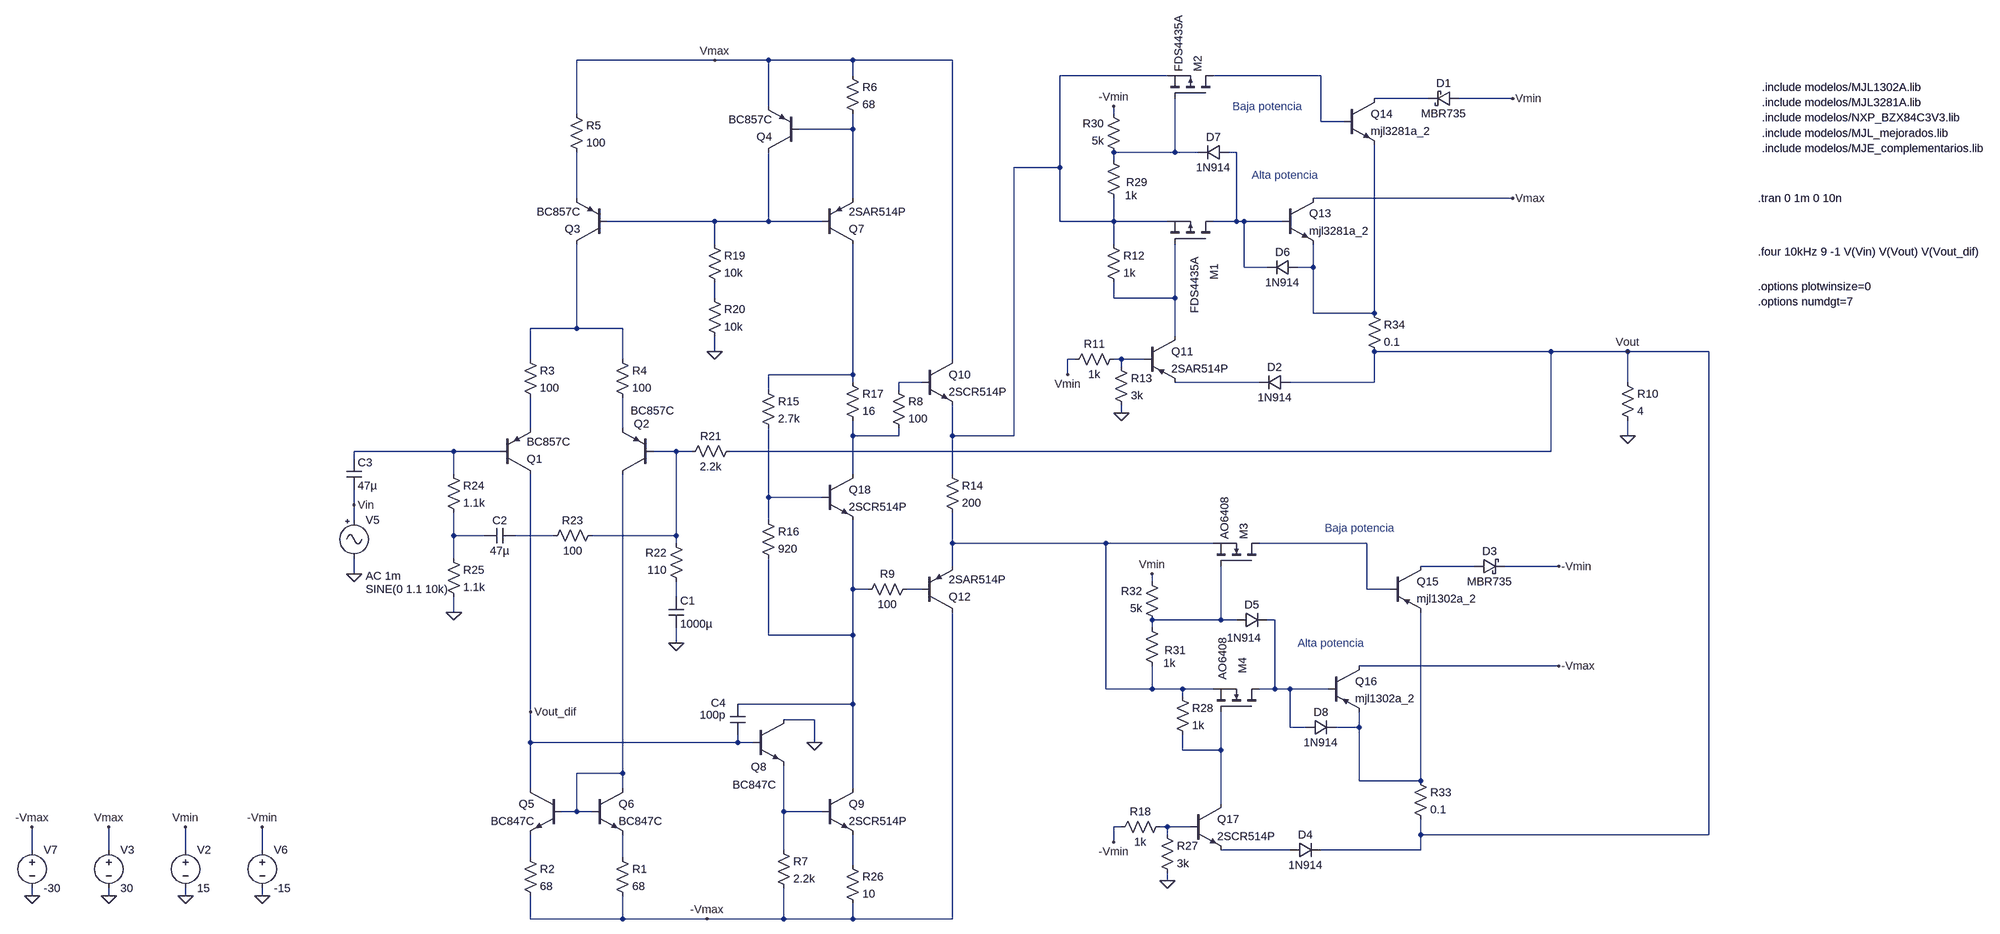
[diagram p0: schematic tp_final_amplificador_salida_paralelo_analisis_distorsion.asc]
tp_final_amplificador_salida_paralelo_analisis_distorsion.asc, the LTspice schematic file:
Version 4
SHEET 1 1744 1200
WIRE -1024 -896 -1312 -896
WIRE -912 -896 -1024 -896
WIRE -736 -896 -912 -896
WIRE -528 -896 -736 -896
WIRE -736 -864 -736 -896
WIRE -80 -864 -304 -864
WIRE 240 -864 16 -864
WIRE 464 -816 352 -816
WIRE 640 -816 528 -816
WIRE -912 -800 -912 -896
WIRE -1312 -784 -1312 -896
WIRE -192 -784 -192 -800
WIRE 240 -768 240 -864
WIRE 288 -768 240 -768
WIRE -736 -752 -736 -784
WIRE -736 -752 -848 -752
WIRE -64 -704 -64 -816
WIRE -64 -704 -192 -704
WIRE -16 -704 -64 -704
WIRE 64 -704 48 -704
WIRE -192 -688 -192 -704
WIRE -304 -672 -304 -864
WIRE -304 -672 -400 -672
WIRE -1312 -608 -1312 -704
WIRE -736 -608 -736 -752
WIRE 640 -608 224 -608
WIRE -1024 -560 -1248 -560
WIRE -912 -560 -912 -704
WIRE -912 -560 -1024 -560
WIRE -800 -560 -912 -560
WIRE -304 -560 -304 -672
WIRE -192 -560 -192 -608
WIRE -192 -560 -304 -560
WIRE -80 -560 -192 -560
WIRE 64 -560 64 -704
WIRE 64 -560 16 -560
WIRE 80 -560 64 -560
WIRE 160 -560 80 -560
WIRE -1024 -512 -1024 -560
WIRE -192 -512 -192 -560
WIRE 80 -464 80 -560
WIRE 128 -464 80 -464
WIRE 224 -464 224 -512
WIRE 224 -464 192 -464
WIRE -1024 -400 -1024 -432
WIRE -192 -400 -192 -432
WIRE -64 -400 -64 -512
WIRE -64 -400 -192 -400
WIRE 224 -368 224 -464
WIRE 352 -368 352 -720
WIRE 352 -368 224 -368
WIRE -1312 -336 -1312 -512
WIRE -1312 -336 -1408 -336
WIRE -1216 -336 -1312 -336
WIRE -64 -320 -64 -400
WIRE -1024 -288 -1024 -320
WIRE 720 -288 352 -288
WIRE 880 -288 720 -288
WIRE 1104 -288 880 -288
WIRE -1408 -272 -1408 -336
WIRE -1216 -272 -1216 -336
WIRE -528 -272 -528 -896
WIRE -272 -272 -288 -272
WIRE -176 -272 -192 -272
WIRE -128 -272 -176 -272
WIRE -176 -256 -176 -272
WIRE -736 -240 -736 -512
WIRE -736 -240 -912 -240
WIRE -288 -240 -288 -272
WIRE -736 -224 -736 -240
WIRE -592 -224 -640 -224
WIRE 112 -224 -64 -224
WIRE 352 -224 352 -288
WIRE 352 -224 176 -224
WIRE 880 -224 880 -288
WIRE -912 -208 -912 -240
WIRE -640 -208 -640 -224
WIRE -176 -160 -176 -176
WIRE -1408 -128 -1408 -192
WIRE -1216 -128 -1216 -192
WIRE -736 -112 -736 -144
WIRE -640 -112 -640 -128
WIRE -640 -112 -736 -112
WIRE -528 -112 -528 -176
WIRE -400 -112 -400 -672
WIRE -400 -112 -528 -112
WIRE 880 -112 880 -144
WIRE -1568 -80 -1776 -80
WIRE -1472 -80 -1568 -80
WIRE -1104 -80 -1152 -80
WIRE -1072 -80 -1104 -80
WIRE 720 -80 720 -288
WIRE 720 -80 -992 -80
WIRE -1776 -64 -1776 -80
WIRE -1568 -32 -1568 -80
WIRE -736 -32 -736 -112
WIRE -528 -32 -528 -112
WIRE -912 16 -912 -128
WIRE -800 16 -912 16
WIRE -1776 32 -1776 0
WIRE -1776 64 -1776 32
WIRE -912 64 -912 16
WIRE -1568 96 -1568 48
WIRE -1504 96 -1568 96
WIRE -1360 96 -1440 96
WIRE -1104 96 -1104 -80
WIRE -1104 96 -1280 96
WIRE -1104 112 -1104 96
WIRE -528 112 -528 48
WIRE -208 112 -528 112
WIRE 16 112 -208 112
WIRE 336 112 112 112
WIRE -1568 144 -1568 96
WIRE -528 160 -528 112
WIRE 560 160 448 160
WIRE 736 160 624 160
WIRE -1776 176 -1776 144
WIRE -112 192 -112 176
WIRE -736 208 -736 64
WIRE -704 208 -736 208
WIRE -592 208 -624 208
WIRE 336 208 336 112
WIRE 384 208 336 208
WIRE -1104 224 -1104 192
WIRE -1568 256 -1568 224
WIRE 32 272 32 160
WIRE 32 272 -112 272
WIRE 64 272 32 272
WIRE 144 272 128 272
WIRE -112 288 -112 272
WIRE -912 304 -912 144
WIRE -736 304 -736 208
WIRE -736 304 -912 304
WIRE -1104 320 -1104 288
WIRE 736 368 320 368
WIRE -208 416 -208 112
WIRE -112 416 -112 368
WIRE -112 416 -208 416
WIRE -48 416 -112 416
WIRE 16 416 -48 416
WIRE 144 416 144 272
WIRE 144 416 112 416
WIRE 176 416 144 416
WIRE 256 416 176 416
WIRE -48 432 -48 416
WIRE -736 448 -736 304
WIRE -736 448 -976 448
WIRE -1408 464 -1408 -32
WIRE -816 480 -880 480
WIRE 176 496 176 416
WIRE 208 496 176 496
WIRE 320 496 320 464
WIRE 320 496 272 496
WIRE -1408 528 -1408 464
WIRE -976 528 -976 512
WIRE -976 528 -1408 528
WIRE -944 528 -976 528
WIRE -816 528 -816 480
WIRE -48 544 -48 512
WIRE 32 544 32 464
WIRE 32 544 -48 544
WIRE -1216 592 -1216 -32
WIRE -1216 592 -1312 592
WIRE 320 608 320 496
WIRE 448 608 448 256
WIRE 448 608 320 608
WIRE -1408 624 -1408 528
WIRE -1216 624 -1216 592
WIRE -736 624 -736 448
WIRE 32 656 32 544
WIRE -1312 672 -1312 592
WIRE -1312 672 -1344 672
WIRE -1280 672 -1312 672
WIRE -880 672 -880 576
WIRE -800 672 -880 672
WIRE -176 704 -192 704
WIRE -80 704 -96 704
WIRE -32 704 -80 704
WIRE -80 720 -80 704
WIRE 448 720 448 688
WIRE 1104 720 1104 -288
WIRE 1104 720 448 720
WIRE -192 736 -192 704
WIRE -3296 752 -3296 704
WIRE -3136 752 -3136 704
WIRE -2976 752 -2976 704
WIRE -2816 752 -2816 704
WIRE -880 752 -880 672
WIRE 176 752 32 752
WIRE 448 752 448 720
WIRE 448 752 240 752
WIRE -1408 768 -1408 720
WIRE -1216 768 -1216 720
WIRE -736 784 -736 720
WIRE -80 816 -80 800
WIRE -3296 848 -3296 832
WIRE -3136 848 -3136 832
WIRE -2976 848 -2976 832
WIRE -2816 848 -2816 832
WIRE -1408 896 -1408 848
WIRE -1216 896 -1216 848
WIRE -1216 896 -1408 896
WIRE -1040 896 -1216 896
WIRE -880 896 -880 832
WIRE -880 896 -1040 896
WIRE -736 896 -736 864
WIRE -736 896 -880 896
WIRE -528 896 -528 256
WIRE -528 896 -736 896
FLAG -816 528 0
FLAG -1024 -288 0
FLAG -1104 320 0
FLAG -1568 256 0
FLAG -1776 176 0
FLAG -2976 848 0
FLAG -2976 704 Vmin
FLAG -3136 704 Vmax
FLAG -3136 848 0
FLAG -2816 848 0
FLAG -2816 704 -Vmin
FLAG -3296 704 -Vmax
FLAG -3296 848 0
FLAG 640 -816 Vmin
FLAG 640 -608 Vmax
FLAG -288 -240 Vmin
FLAG -176 -160 0
FLAG 736 160 -Vmin
FLAG 736 368 -Vmax
FLAG -192 736 -Vmin
FLAG -80 816 0
FLAG -1024 -896 Vmax
FLAG -1040 896 -Vmax
FLAG 880 -112 0
FLAG -192 -800 -Vmin
FLAG -112 176 Vmin
FLAG 880 -288 Vout
FLAG -1408 464 Vout_dif
FLAG -1776 32 Vin
SYMBOL pnp -1472 -32 M180
SYMATTR InstName Q1
SYMATTR Value BC857C
SYMBOL pnp -1152 -32 R180
WINDOW 0 8 105 Left 2
WINDOW 3 -44 133 Left 2
SYMATTR InstName Q2
SYMATTR Value BC857C
SYMBOL pnp -1248 -512 R180
SYMATTR InstName Q3
SYMATTR Value BC857C
SYMBOL pnp -848 -704 R180
SYMATTR InstName Q4
SYMATTR Value BC857C
SYMBOL npn -1344 624 M0
SYMATTR InstName Q5
SYMATTR Value BC847C
SYMBOL npn -1280 624 R0
SYMATTR InstName Q6
SYMATTR Value BC847C
SYMBOL res -1232 752 R0
SYMATTR InstName R1
SYMATTR Value 68
SYMBOL res -1424 752 R0
SYMATTR InstName R2
SYMATTR Value 68
SYMBOL res -1424 -288 R0
SYMATTR InstName R3
SYMATTR Value 100
SYMBOL res -1232 -288 R0
SYMATTR InstName R4
SYMATTR Value 100
SYMBOL res -1328 -800 R0
SYMATTR InstName R5
SYMATTR Value 100
SYMBOL res -752 -880 R0
SYMATTR InstName R6
SYMATTR Value 68
SYMBOL pnp -800 -512 M180
SYMATTR InstName Q7
SYMATTR Value 2SAR514P
SYMBOL npn -944 480 R0
WINDOW 0 -4 99 Left 2
WINDOW 3 -43 136 Left 2
SYMATTR InstName Q8
SYMATTR Value BC847C
SYMBOL npn -800 624 R0
SYMATTR InstName Q9
SYMATTR Value 2SCR514P
SYMBOL res -896 736 R0
SYMATTR InstName R7
SYMATTR Value 2.2k
SYMBOL res -608 192 R90
WINDOW 0 0 56 VBottom 2
WINDOW 3 32 56 VTop 2
SYMATTR InstName R9
SYMATTR Value 100
SYMBOL npn -592 -272 R0
SYMATTR InstName Q10
SYMATTR Value 2SCR514P
SYMBOL pnp -592 256 M180
SYMATTR InstName Q12
SYMATTR Value 2SAR514P
SYMBOL npn -800 -32 R0
SYMATTR InstName Q18
SYMATTR Value 2SCR514P
SYMBOL res -928 -224 R0
SYMATTR InstName R15
SYMATTR Value 2.7k
SYMBOL res -928 48 R0
SYMATTR InstName R16
SYMATTR Value 920
SYMBOL res -752 -240 R0
SYMATTR InstName R17
SYMATTR Value 16
SYMBOL res -1040 -528 R0
SYMATTR InstName R19
SYMATTR Value 10k
SYMBOL res -1040 -416 R0
SYMATTR InstName R20
SYMATTR Value 10k
SYMBOL res -976 -96 R90
WINDOW 0 0 56 VBottom 2
WINDOW 3 32 56 VTop 2
SYMATTR InstName R21
SYMATTR Value 2.2k
SYMBOL res -1088 208 R180
WINDOW 0 36 76 Left 2
WINDOW 3 36 40 Left 2
SYMATTR InstName R22
SYMATTR Value 110
SYMBOL cap -1120 224 R0
SYMATTR InstName C1
SYMATTR Value 1000µ
SYMBOL res -1264 80 R90
WINDOW 0 0 56 VBottom 2
WINDOW 3 32 56 VTop 2
SYMATTR InstName R23
SYMATTR Value 100
SYMBOL cap -1440 80 R90
WINDOW 0 0 32 VBottom 2
WINDOW 3 32 32 VTop 2
SYMATTR InstName C2
SYMATTR Value 47µ
SYMBOL res -1584 -48 R0
SYMATTR InstName R24
SYMATTR Value 1.1k
SYMBOL res -1584 128 R0
SYMATTR InstName R25
SYMATTR Value 1.1k
SYMBOL cap -1792 -64 R0
SYMATTR InstName C3
SYMATTR Value 47µ
SYMBOL res -752 768 R0
SYMATTR InstName R26
SYMATTR Value 10
SYMBOL Misc\\signal -1776 48 R0
WINDOW 123 24 132 Left 2
WINDOW 39 0 0 Left 0
WINDOW 3 24 160 Left 2
SYMATTR Value2 AC 1m
SYMATTR Value SINE(0 1.1 10k)
SYMATTR InstName V5
SYMBOL cap -992 448 R0
WINDOW 0 -40 -3 Left 2
WINDOW 3 -63 22 Left 2
SYMATTR InstName C4
SYMATTR Value 100p
SYMBOL res -656 -224 R0
SYMATTR InstName R8
SYMATTR Value 100
SYMBOL voltage -2976 736 R0
WINDOW 123 0 0 Left 0
WINDOW 39 0 0 Left 0
SYMATTR InstName V2
SYMATTR Value 15
SYMBOL voltage -3136 736 R0
WINDOW 123 0 0 Left 0
WINDOW 39 0 0 Left 0
SYMATTR InstName V3
SYMATTR Value 30
SYMBOL voltage -2816 736 R0
WINDOW 123 0 0 Left 0
WINDOW 39 0 0 Left 0
SYMATTR InstName V6
SYMATTR Value -15
SYMBOL voltage -3296 736 R0
WINDOW 123 0 0 Left 0
WINDOW 39 0 0 Left 0
SYMATTR InstName V7
SYMATTR Value -30
SYMBOL pmos 16 -512 M270
WINDOW 0 -74 -2 Left 2
WINDOW 3 -144 39 Left 2
SYMATTR InstName M1
SYMATTR Value FDS4435A
SYMBOL pmos 16 -816 M270
SYMATTR InstName M2
SYMATTR Value FDS4435A
SYMBOL pnp -128 -320 R0
SYMATTR InstName Q11
SYMATTR Value 2SAR514P
SYMBOL npn 160 -608 R0
SYMATTR InstName Q13
SYMATTR Value mjl3281a_2
SYMBOL npn 288 -816 R0
SYMATTR InstName Q14
SYMATTR Value mjl3281a_2
SYMBOL res -176 -288 R90
WINDOW 0 0 56 VBottom 2
WINDOW 3 32 56 VTop 2
SYMATTR InstName R11
SYMATTR Value 1k
SYMBOL res -208 -528 R0
SYMATTR InstName R12
SYMATTR Value 1k
SYMBOL schottky 528 -832 R90
WINDOW 0 0 32 VBottom 2
WINDOW 3 32 32 VTop 2
SYMATTR InstName D1
SYMATTR Value MBR735
SYMATTR Description Diode
SYMATTR Type diode
SYMBOL res -192 -272 R0
SYMATTR InstName R13
SYMATTR Value 3k
SYMBOL res -80 688 R90
WINDOW 0 0 56 VBottom 2
WINDOW 3 32 56 VTop 2
SYMATTR InstName R18
SYMATTR Value 1k
SYMBOL schottky 560 176 R270
WINDOW 0 32 32 VTop 2
WINDOW 3 0 32 VBottom 2
SYMATTR InstName D3
SYMATTR Value MBR735
SYMATTR Description Diode
SYMATTR Type diode
SYMBOL res -96 704 R0
SYMATTR InstName R27
SYMATTR Value 3k
SYMBOL pnp 384 160 R0
SYMATTR InstName Q15
SYMATTR Value mjl1302a_2
SYMBOL pnp 256 368 R0
SYMATTR InstName Q16
SYMATTR Value mjl1302a_2
SYMBOL nmos 112 160 M270
SYMATTR InstName M3
SYMATTR Value AO6408
SYMBOL nmos 112 464 M270
WINDOW 0 80 35 Left 2
WINDOW 3 67 76 Left 2
SYMATTR InstName M4
SYMATTR Value AO6408
SYMBOL res -64 416 R0
SYMATTR InstName R28
SYMATTR Value 1k
SYMBOL npn -32 656 R0
SYMATTR InstName Q17
SYMATTR Value 2SCR514P
SYMBOL res 864 -240 R0
SYMATTR InstName R10
SYMATTR Value 4
SYMBOL res -544 -48 R0
SYMATTR InstName R14
SYMATTR Value 200
SYMBOL diode 176 -240 R90
WINDOW 0 0 32 VBottom 2
WINDOW 3 32 32 VTop 2
SYMATTR InstName D2
SYMATTR Value 1N914
SYMBOL diode 176 768 R270
WINDOW 0 32 32 VTop 2
WINDOW 3 0 32 VBottom 2
SYMATTR InstName D4
SYMATTR Value 1N914
SYMBOL res -208 -704 R0
WINDOW 0 42 63 Left 2
WINDOW 3 40 90 Left 2
SYMATTR InstName R29
SYMATTR Value 1k
SYMBOL res -176 -688 R180
WINDOW 0 36 76 Left 2
WINDOW 3 36 40 Left 2
SYMATTR InstName R30
SYMATTR Value 5k
SYMBOL res -128 272 R0
WINDOW 0 42 63 Left 2
WINDOW 3 40 90 Left 2
SYMATTR InstName R31
SYMATTR Value 1k
SYMBOL res -96 288 R180
WINDOW 0 36 76 Left 2
WINDOW 3 36 40 Left 2
SYMATTR InstName R32
SYMATTR Value 5k
SYMBOL diode 48 -720 R90
WINDOW 0 0 32 VBottom 2
WINDOW 3 32 32 VTop 2
SYMATTR InstName D7
SYMATTR Value 1N914
SYMBOL diode 64 288 R270
WINDOW 0 32 32 VTop 2
WINDOW 3 -6 16 VBottom 2
SYMATTR InstName D5
SYMATTR Value 1N914
SYMBOL diode 192 -480 R90
WINDOW 0 0 32 VBottom 2
WINDOW 3 32 32 VTop 2
SYMATTR InstName D6
SYMATTR Value 1N914
SYMBOL diode 208 512 R270
WINDOW 0 32 32 VTop 2
WINDOW 3 0 32 VBottom 2
SYMATTR InstName D8
SYMATTR Value 1N914
SYMBOL res 432 592 R0
SYMATTR InstName R33
SYMATTR Value 0.1
SYMBOL res 336 -384 R0
SYMATTR InstName R34
SYMATTR Value 0.1
TEXT 1248 -840 Left 2 !.include modelos/MJL1302A.lib
TEXT 1248 -808 Left 2 !.include modelos/MJL3281A.lib
TEXT 1248 -776 Left 2 !.include modelos/NXP_BZX84C3V3.lib
TEXT 1248 -744 Left 2 !.include modelos/MJL_mejorados.lib
TEXT 1248 -712 Left 2 !.include modelos/MJE_complementarios.lib
TEXT 56 -800 Left 2 ;Baja potencia
TEXT 96 -656 Left 2 ;Alta potencia
TEXT 248 80 Left 2 ;Baja potencia
TEXT 192 320 Left 2 ;Alta potencia
TEXT 1240 -608 Left 2 !.tran 0 1m 0 10n
TEXT 1240 -496 Left 2 !.four 10kHz 9 -1 V(Vin) V(Vout) V(Vout_dif)
TEXT 1240 -424 Left 2 !.options plotwinsize=0
TEXT 1240 -392 Left 2 !.options numdgt=7

The netlist it stands for:
* tp_final_amplificador_salida_paralelo_analisis_distorsion.asc
Q1 Vout_dif N020 N017 0 BC857C
Q2 N035 N021 N018 0 BC857C
Q3 N012 N008 N007 0 BC857C
Q4 N008 N004 Vmax 0 BC857C
Q5 Vout_dif N035 N039 0 BC847C
Q6 N035 N035 N040 0 BC847C
R1 N040 -Vmax 68
R2 N039 -Vmax 68
R3 N012 N017 100
R4 N012 N018 100
R5 Vmax N007 100
R6 Vmax N004 68
Q7 N014 N008 N004 0 2SAR514P
Q8 0 Vout_dif N036 0 BC847C
Q9 N028 N036 N041 0 2SCR514P
R7 N036 -Vmax 2.2k
R9 N029 N028 100
Q10 Vmax N015 N001 0 2SCR514P
Q12 -Vmax N029 N025 0 2SAR514P
Q18 N019 N022 N028 0 2SCR514P
R15 N014 N022 2.7k
R16 N022 N028 920
R17 N014 N019 16
R19 N008 N010 10k
R20 N010 0 10k
R21 Vout N021 2.2k
R22 N030 N021 110
C1 N030 0 1000µ
R23 N021 N024 100
C2 N024 N023 47µ
R24 N020 N023 1.1k
R25 N023 0 1.1k
C3 N020 Vin 47µ
R26 N041 -Vmax 10
V5 Vin 0 SINE(0 1.1 10k) AC 1m
C4 N028 Vout_dif 100p
R8 N015 N019 100
V2 Vmin 0 15
V3 Vmax 0 30
V6 -Vmin 0 -15
V7 -Vmax 0 -30
M1 N006 N011 N001 N001 FDS4435A
M2 N002 N005 N001 N001 FDS4435A
Q11 N011 N013 N016 0 2SAR514P
Q13 Vmax N006 N009 0 mjl3281a_2
Q14 N003 N002 N009 0 mjl3281a_2
R11 N013 Vmin 1k
R12 N001 N011 1k
D1 Vmin N003 MBR735
R13 N013 0 3k
R18 N037 -Vmin 1k
D3 N027 -Vmin MBR735
R27 N037 0 3k
Q15 N027 N026 N033 0 mjl1302a_2
Q16 -Vmax N032 N033 0 mjl1302a_2
M3 N026 N031 N025 N025 AO6408
M4 N032 N034 N025 N025 AO6408
R28 N025 N034 1k
Q17 N034 N037 N038 0 2SCR514P
R10 Vout 0 4
R14 N001 N025 200
D2 Vout N016 1N914
D4 N038 Vout 1N914
R29 N005 N001 1k
R30 N005 -Vmin 5k
R31 N031 N025 1k
R32 N031 Vmin 5k
D7 N006 N005 1N914
D5 N031 N032 1N914
D6 N009 N006 1N914
D8 N032 N033 1N914
R33 N033 Vout 0.1
R34 N009 Vout 0.1
.model D D
.lib standard.dio
.model NPN NPN
.model PNP PNP
.lib standard.bjt
.model NMOS NMOS
.model PMOS PMOS
.lib standard.mos
.include modelos/MJL1302A.lib
.include modelos/MJL3281A.lib
.include modelos/NXP_BZX84C3V3.lib
.include modelos/MJL_mejorados.lib
.include modelos/MJE_complementarios.lib
* Baja potencia
* Alta potencia
* Baja potencia
* Alta potencia
.tran 0 1m 0 10n
.four 10kHz 9 -1 V(Vin) V(Vout) V(Vout_dif)
.options plotwinsize=0
.options numdgt=7
.backanno
.end